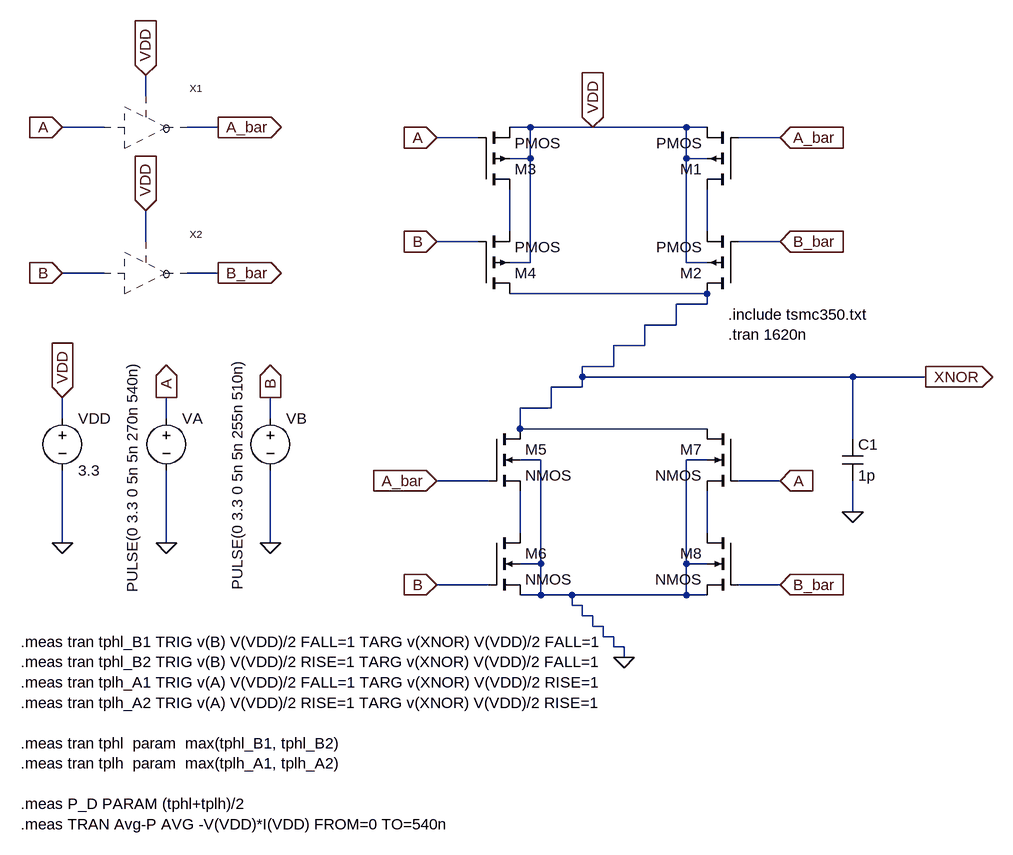
[diagram p0: schematic XNOR.asc]
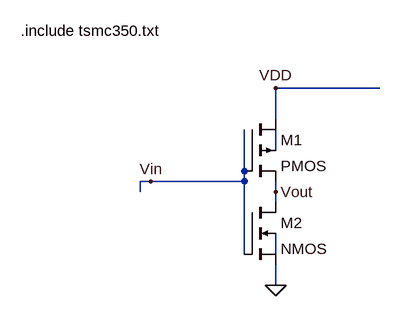
[diagram p1: sub-circuit symb.asc]
XNOR.asc, the LTspice schematic file:
Version 4
SHEET 1 1976 1096
WIRE -128 0 -128 -32
WIRE -192 48 -256 48
WIRE -16 48 -64 48
WIRE 464 48 432 48
WIRE 560 48 464 48
WIRE 704 48 560 48
WIRE 736 48 704 48
WIRE 384 64 320 64
WIRE 848 64 784 64
WIRE 464 96 464 48
WIRE 464 96 432 96
WIRE 704 96 704 48
WIRE 736 96 704 96
WIRE 432 208 432 144
WIRE 736 208 736 144
WIRE -128 224 -128 176
WIRE 384 224 320 224
WIRE 848 224 784 224
WIRE 464 256 464 96
WIRE 464 256 432 256
WIRE 704 256 704 96
WIRE 736 256 704 256
WIRE -192 272 -256 272
WIRE -16 272 -64 272
WIRE 736 304 432 304
WIRE 736 320 736 304
WIRE 736 320 688 320
WIRE 688 352 688 320
WIRE 688 352 640 352
WIRE 640 384 640 352
WIRE 640 384 592 384
WIRE 592 416 592 384
WIRE 592 416 544 416
WIRE 544 432 544 416
WIRE 960 432 544 432
WIRE 1072 432 960 432
WIRE 544 448 544 432
WIRE 544 448 496 448
WIRE 496 480 496 448
WIRE 496 480 448 480
WIRE -256 496 -256 464
WIRE -96 496 -96 464
WIRE 64 496 64 464
WIRE 448 512 448 480
WIRE 736 512 448 512
WIRE 960 528 960 432
WIRE 480 560 448 560
WIRE 736 560 704 560
WIRE 400 592 320 592
WIRE 848 592 784 592
WIRE 960 640 960 592
WIRE 448 672 448 608
WIRE 736 672 736 608
WIRE -256 688 -256 576
WIRE -96 688 -96 576
WIRE 64 688 64 576
WIRE 480 720 480 560
WIRE 480 720 448 720
WIRE 704 720 704 560
WIRE 736 720 704 720
WIRE 400 752 320 752
WIRE 848 752 784 752
WIRE 480 768 480 720
WIRE 480 768 448 768
WIRE 528 768 480 768
WIRE 704 768 704 720
WIRE 704 768 528 768
WIRE 736 768 704 768
WIRE 528 784 528 768
WIRE 544 784 528 784
WIRE 544 800 544 784
WIRE 560 800 544 800
WIRE 560 816 560 800
WIRE 576 816 560 816
WIRE 576 832 576 816
WIRE 592 832 576 832
WIRE 592 848 592 832
WIRE 608 848 592 848
WIRE 608 864 608 848
FLAG 608 864 0
FLAG -96 688 0
FLAG -256 688 0
FLAG 64 688 0
FLAG -128 -32 VDD
IOPIN -128 -32 In
FLAG -16 48 A_bar
IOPIN -16 48 Out
FLAG -128 176 VDD
IOPIN -128 176 In
FLAG -256 272 B
IOPIN -256 272 In
FLAG -16 272 B_bar
IOPIN -16 272 Out
FLAG -256 464 VDD
IOPIN -256 464 In
FLAG -96 464 A
IOPIN -96 464 Out
FLAG 64 464 B
IOPIN 64 464 Out
FLAG 320 592 A_bar
IOPIN 320 592 In
FLAG 320 752 B
IOPIN 320 752 In
FLAG 848 592 A
IOPIN 848 592 In
FLAG 848 752 B_bar
IOPIN 848 752 In
FLAG 320 64 A
IOPIN 320 64 In
FLAG 320 224 B
IOPIN 320 224 In
FLAG 848 64 A_bar
IOPIN 848 64 In
FLAG 848 224 B_bar
IOPIN 848 224 In
FLAG 560 48 VDD
IOPIN 560 48 In
FLAG 960 640 0
FLAG 1072 432 XNOR
IOPIN 1072 432 Out
FLAG -256 48 A
IOPIN -256 48 In
SYMBOL pmos4 784 144 R180
SYMATTR InstName M1
SYMATTR Value2 l=350n w=90u
SYMBOL pmos4 784 304 R180
SYMATTR InstName M2
SYMATTR Value2 l=350n w=90u
SYMBOL pmos4 384 144 M180
SYMATTR InstName M3
SYMATTR Value2 l=350n w=90u
SYMBOL pmos4 384 304 M180
SYMATTR InstName M4
SYMATTR Value2 l=350n w=90u
SYMBOL nmos4 400 512 R0
SYMATTR InstName M5
SYMATTR Value2 l=350n w=10u
SYMBOL nmos4 400 672 R0
SYMATTR InstName M6
SYMATTR Value2 l=350n w=10u
SYMBOL nmos4 784 512 M0
SYMATTR InstName M7
SYMATTR Value2 l=350n w=10u
SYMBOL nmos4 784 672 M0
SYMATTR InstName M8
SYMATTR Value2 l=350n w=10u
SYMBOL Voltage -256 480 R0
SYMATTR InstName VDD
SYMATTR Value 3.3
SYMBOL Voltage -96 480 R0
WINDOW 3 -52 -74 VRight 2
SYMATTR Value PULSE(0 3.3 0 5n 5n 270n 540n)
SYMATTR InstName VA
SYMBOL Voltage 64 480 R0
WINDOW 3 -51 -78 VRight 2
SYMATTR Value PULSE(0 3.3 0 5n 5n 255n 510n)
SYMATTR InstName VB
SYMBOL symb -128 48 R0
SYMATTR InstName X1
SYMBOL symb -128 272 R0
SYMATTR InstName X2
SYMBOL Cap 944 528 R0
SYMATTR InstName C1
SYMATTR Value 1p
TEXT 768 336 Left 2 !.include tsmc350.txt\n.tran 1620n
TEXT -320 840 Left 2 !.meas tran tphl_B1 TRIG v(B) V(VDD)/2 FALL=1 TARG v(XNOR) V(VDD)/2 FALL=1\n.meas tran tphl_B2 TRIG v(B) V(VDD)/2 RISE=1 TARG v(XNOR) V(VDD)/2 FALL=1\n.meas tran tplh_A1 TRIG v(A) V(VDD)/2 FALL=1 TARG v(XNOR) V(VDD)/2 RISE=1\n.meas tran tplh_A2 TRIG v(A) V(VDD)/2 RISE=1 TARG v(XNOR) V(VDD)/2 RISE=1\n\n.meas tran tphl  param  max(tphl_B1, tphl_B2)\n.meas tran tplh  param  max(tplh_A1, tplh_A2)\n\n.meas P_D PARAM (tphl+tplh)/2\n.meas TRAN Avg-P AVG -V(VDD)*I(VDD) FROM=0 TO=540n

symb.asc, the sub-circuit schematic file:
Version 4
SHEET 1 880 680
WIRE 560 176 400 176
WIRE 400 224 400 176
WIRE 400 272 400 240
WIRE 352 304 352 240
WIRE 208 320 192 320
WIRE 352 320 352 304
WIRE 352 320 208 320
WIRE 192 336 192 320
WIRE 400 336 400 320
WIRE 400 352 400 336
WIRE 352 432 352 320
WIRE 400 432 400 400
WIRE 400 480 400 448
FLAG 400 480 0
FLAG 208 320 Vin
FLAG 400 176 VDD
FLAG 400 336 Vout
SYMBOL pmos4 352 224 R0
SYMATTR InstName M1
SYMATTR Value2 l=350n w=2u
SYMBOL nmos4 352 352 R0
SYMATTR InstName M2
SYMATTR Value2 l=350n w=1u
TEXT 8 88 Left 2 !.include tsmc350.txt

The netlist it stands for:
* XNOR.asc
M1 N002 A_bar VDD VDD PMOS l=350n w=90u
M2 XNOR B_bar N002 VDD PMOS l=350n w=90u
M3 N001 A VDD VDD PMOS l=350n w=90u
M4 XNOR B N001 VDD PMOS l=350n w=90u
M5 XNOR A_bar N003 0 NMOS l=350n w=10u
M6 N003 B 0 0 NMOS l=350n w=10u
M7 XNOR A N004 0 NMOS l=350n w=10u
M8 N004 B_bar 0 0 NMOS l=350n w=10u
VDD VDD 0 3.3
VA A 0 PULSE(0 3.3 0 5n 5n 270n 540n)
VB B 0 PULSE(0 3.3 0 5n 5n 255n 510n)
XX1 A VDD A_bar symb
XX2 B VDD B_bar symb
C1 XNOR 0 1p

* block symbol definitions
.subckt symb Vin VDD Vout
M1 VDD Vin Vout N001 PMOS l=350n w=2u
M2 Vout Vin 0 N002 NMOS l=350n w=1u
.include tsmc350.txt
.ends symb

.model NMOS NMOS
.model PMOS PMOS
.lib standard.mos
.include tsmc350.txt
.tran 1620n
.meas tran tphl_B1 TRIG v(B) V(VDD)/2 FALL=1 TARG v(XNOR) V(VDD)/2 FALL=1
.meas tran tphl_B2 TRIG v(B) V(VDD)/2 RISE=1 TARG v(XNOR) V(VDD)/2 FALL=1
.meas tran tplh_A1 TRIG v(A) V(VDD)/2 FALL=1 TARG v(XNOR) V(VDD)/2 RISE=1
.meas tran tplh_A2 TRIG v(A) V(VDD)/2 RISE=1 TARG v(XNOR) V(VDD)/2 RISE=1
.meas tran tphl  param  max(tphl_B1, tphl_B2)
.meas tran tplh  param  max(tplh_A1, tplh_A2)
.meas P_D PARAM (tphl+tplh)/2
.meas TRAN Avg-P AVG -V(VDD)*I(VDD) FROM=0 TO=540n
.backanno
.end